# Altium schematic sheet IR2111+IRFZ44.SchDoc
size A3
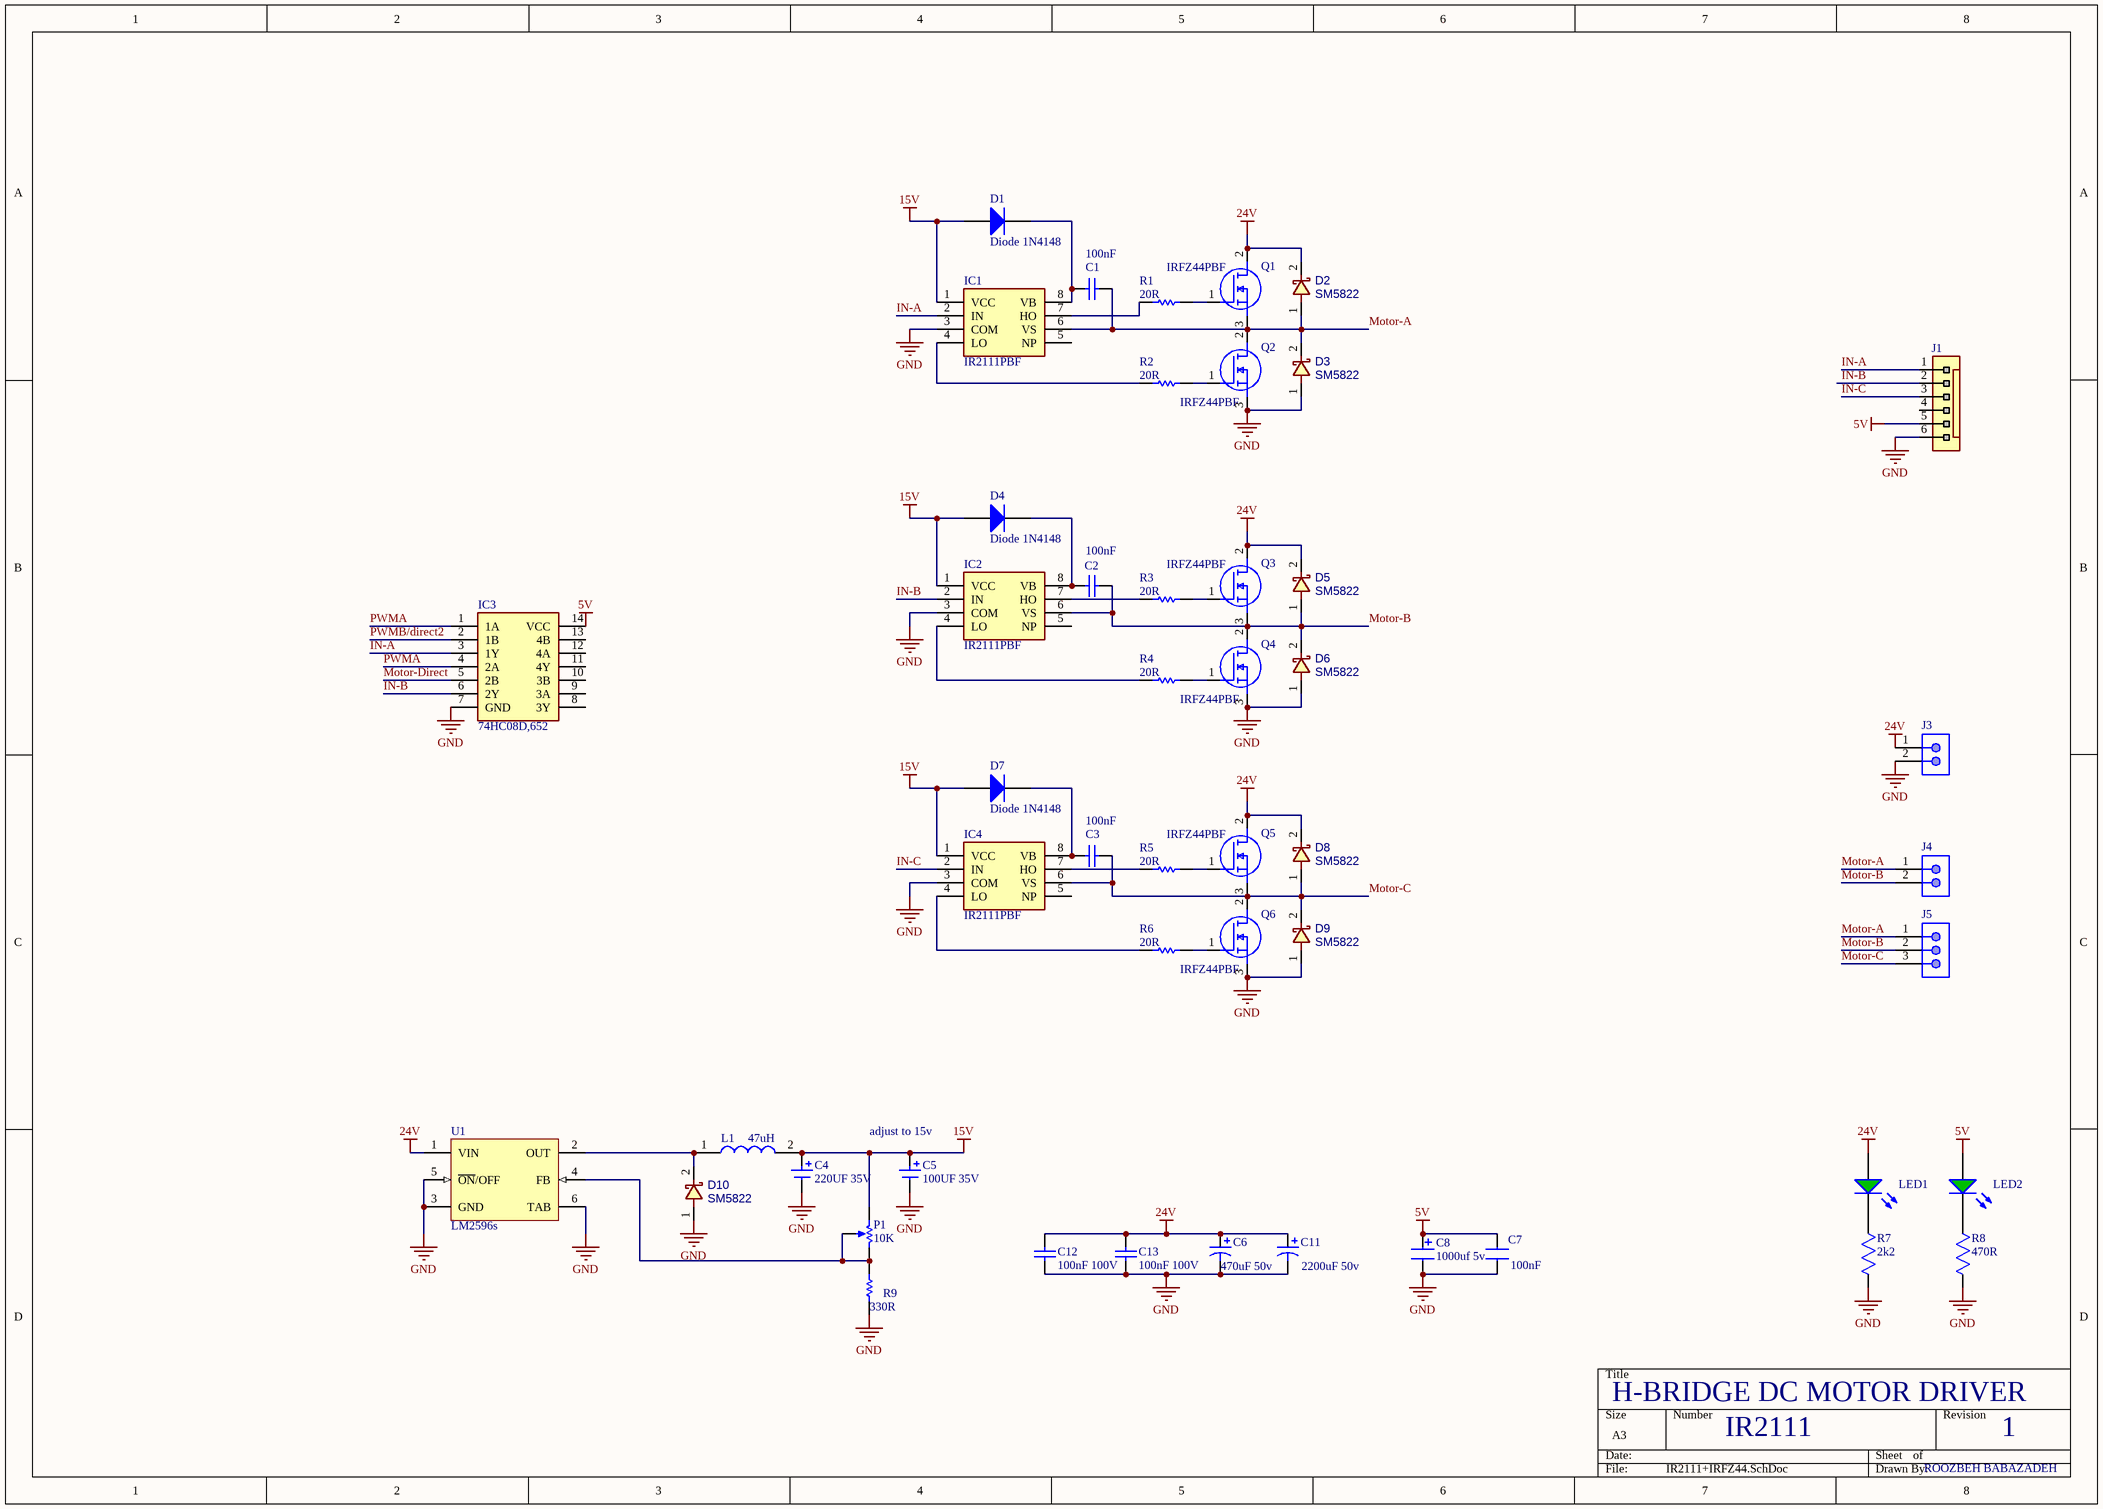
[diagram p0: IR2111+IRFZ44.SchDoc]

## Parts
C1  100nF  [C0805]
C2  100nF  [C0805]
C3  100nF  [C0805]
C4  220UF 35V  [C_EL_8X12]
C5  100UF 35V  [C_EL_8X12]
C6  470uF 50v  [C_EL_10X12]
C7  100nF  [C0805]
C8  1000uf 5v  [C_EL_8X12]
C11  2200uF 50v  [C_EL_16X25]
C12  100nF 100V  [C_CER_D7B]
C13  100nF 100V  [C_CER_D7B]
D1  Diode 1N4148  [D_SOD123W]
D2  SM5822  [D_SMB]
D3  SM5822  [D_SMB]
D4  Diode 1N4148  [D_SOD123W]
D5  SM5822  [D_SMB]
D6  SM5822  [D_SMB]
D7  Diode 1N4148  [D_SOD123W]
D8  SM5822  [D_SMB]
D9  SM5822  [D_SMB]
D10  SM5822  [D_SMB]
IC1  IR2111PBF  [SO_8]
IC2  IR2111PBF  [SO_8]
IC3  74HC08D,652  [SO_14]
IC4  IR2111PBF  [SO_8]
J1  HDRWF_6  [WF_6]  (value not drawn)
J3  2PIN  3.96  [PWL_2]  (value not drawn)
J4  2PIN  3.96  [PWL_2]  (value not drawn)
J5  3PIN  3.96  [PWL_3]  (value not drawn)
L1  47uH  [CDRH127LDNP560MC-12*12]
LED1  (no value)  [LED1206RED]
LED2  (no value)  [LED1206RED]
P1  10K  [POT_3296W]
Q1  IRFZ44PBF  [D2PAK3]
Q2  IRFZ44PBF  [D2PAK3]
Q3  IRFZ44PBF  [D2PAK3]
Q4  IRFZ44PBF  [D2PAK3]
Q5  IRFZ44PBF  [D2PAK3]
Q6  IRFZ44PBF  [D2PAK3]
R1  20R  [R0805]
R2  20R  [R0805]
R3  20R  [R0805]
R4  20R  [R0805]
R5  20R  [R0805]
R6  20R  [R0805]
R7  2k2  [R0805]
R8  470R  [R0805]
R9  330R  [R0805]
U1  LM2596s  [to-263-5 5d2pak LM2596S]

## Nets
5V: C7.2 C8.1 IC3.14(VCC) J1.5 LED2.1(A)
15V: C4.1 C5.1 D1.1(A) D4.1(A) D7.1(A) IC1.1(VCC) IC2.1(VCC) IC4.1(VCC) L1.2 P1.3(BOT)
24V: C6.1 C11.1 C12.2 C13.2 D2.2 D5.2 D8.2 J3.1 LED1.1(A) Q1.2(D) Q3.2(D) Q5.2(D) U1.1(VIN)
GND: C4.2 C5.2 C6.2 C7.1 C8.2 C11.2 C12.1 C13.1 D3.1 D6.1 D9.1 D10.1 IC1.3(COM) IC2.3(COM) IC3.7(GND) IC4.3(COM) J1.6 J3.2 Q2.3(S) Q4.3(S) Q6.3(S) R7.2 R8.2 R9.1 U1.3(GND) U1.5(~{ON}/OFF) U1.6(TAB)
IN-A: IC1.2(IN) IC3.3(1Y) J1.1
IN-B: IC2.2(IN) IC3.6(2Y) J1.2
IN-C: IC4.2(IN) J1.3
Motor-A: C1.1 D2.1 D3.2 IC1.6(VS) J4.1 J5.1 Q1.3(S) Q2.2(D)
Motor-B: C2.1 D5.1 D6.2 IC2.6(VS) J4.2 J5.2 Q3.3(S) Q4.2(D)
Motor-C: C3.1 D8.1 D9.2 IC4.6(VS) J5.3 Q5.3(S) Q6.2(D)
Motor-Direct: IC3.5(2B)
PWMA: IC3.1(1A) IC3.4(2A)
PWMB/direct2: IC3.2(1B)
NetC1_2: C1.2 D1.2(K) IC1.8(VB)
NetC2_2: C2.2 D4.2(K) IC2.8(VB)
NetC3_2: C3.2 D7.2(K) IC4.8(VB)
NetD10_2: D10.2 L1.1 U1.2(OUT)
NetIC1_4: IC1.4(LO) R2.1
NetIC1_7: IC1.7(HO) R1.1
NetIC2_4: IC2.4(LO) R4.1
NetIC2_7: IC2.7(HO) R3.1
NetIC4_4: IC4.4(LO) R6.1
NetIC4_7: IC4.7(HO) R5.1
NetLED1_2: LED1.2(K) R7.1
NetLED2_2: LED2.2(K) R8.1
NetP1_1: P1.1(TOP) P1.2(TAP) R9.2 U1.4(FB)
NetQ1_1: Q1.1(G) R1.2
NetQ2_1: Q2.1(G) R2.2
NetQ3_1: Q3.1(G) R3.2
NetQ4_1: Q4.1(G) R4.2
NetQ5_1: Q5.1(G) R5.2
NetQ6_1: Q6.1(G) R6.2

Not connected (* = marked no-connect by the designer): IC1 5(NP); IC2 5(NP); IC3 8(3Y) 9(3A) 10(3B) 11(4Y) 12(4A) 13(4B); IC4 5(NP); J1 4

## Notes on the sheet
- (near C5) adjust to 15v
- H-BRIDGE DC MOTOR DRIVER
- IR2111
- 1
- ROOZBEH BABAZADEH

## Library data of the parts
C1-C3 = Cap: Capacitor; Published: 8-Jun-2000; LatestRevisionDate: 17-Jul-2002; LatestRevisionNote: Re-released for DXP Platform.; PackageReference: RAD-0.3; Publisher: Altium Limited; PackageDescription: Radial Cap, Thru-Hole; 2 Leads; 0.3 in Pin Spacing; Value: 100nF
C4 C5 = CAP_ELECTRO_POLIMER
C6 C11 = Cap 220uF: 63VDC
C7 = C
C8 = CAP3528
C12 = Cap 100nF
C13 = Cap: 63VDC; Value: 10nF; Published: 8-Jun-2000; LatestRevisionDate: 17-Jul-2002; LatestRevisionNote: Re-released for DXP Platform.; PackageReference: RAD-0.3; Publisher: Altium Limited; PackageDescription: Radial Cap, Thru-Hole; 2 Leads; 0.3 in Pin Spacing
D1 = Diode 1N4005: Published: 8-Jun-2000; LatestRevisionDate: 17-Jul-2002; LatestRevisionNote: Re-released for DXP Platform.; DatasheetVersion: 1998; PackageVersion: Aug-1999; PackageReference: DO-41; Publisher: Altium Limited; PackageDescription: Diode, Axial; Body 5.2 x 2.7 mm (LxDia. max), Lead Dia. 0.86 mm (max); Code_JEDEC: DO-204-AL; ComponentLink1Description: Manufacturer Link; ComponentLink1URL: http://www.fairchildsemi.com/; ComponentLink2Description: Datasheet; ComponentLink2URL: http://www.fairchildsemi.com/ds/1N%2F1N4001.pdf
D2 D3 D5 D6 D8-D10 = SCHOTTKY: DIODE, SCHOTTKY, 50V, 3A; MANF: DIODES; MANF_P#: 1N5819HW-7-F; DESC: DESCRIPTION; PARAM2: 1A; PARAM: 40V; ASSEMBLY: ASSEMBLY; PRICE: PRICE; VALUE: ?
D4 D7 = Diode 1N4005: 1 Amp General Purpose Rectifier; Published: 8-Jun-2000; LatestRevisionDate: 17-Jul-2002; LatestRevisionNote: Re-released for DXP Platform.; DatasheetVersion: 1998; PackageVersion: Aug-1999; PackageReference: DO-41; Publisher: Altium Limited; PackageDescription: Diode, Axial; Body 5.2 x 2.7 mm (LxDia. max), Lead Dia. 0.86 mm (max); Code_JEDEC: DO-204-AL; ComponentLink1Description: Manufacturer Link; ComponentLink1URL: http://www.fairchildsemi.com/; ComponentLink2Description: Datasheet; ComponentLink2URL: http://www.fairchildsemi.com/ds/1N%2F1N4001.pdf
IC1 IC2 IC4 = IR2111PBF: Integrated Circuit; Manufacturer_Name: Infineon; Datasheet Link: https://componentsearchengine.com/Datasheets/2/IR2111PBF.pdf; Height: 5.33mm; Manufacturer_Part_Number: IR2111PBF; Arrow Part Number: IR2111PBF; Arrow Price/Stock: https://www.arrow.com/en/products/ir2111pbf/infineon-technologies-ag; Mouser Part Number: 942-IR2111PBF; Mouser Price/Stock: https://www.mouser.co.uk/ProductDetail/Infineon-IR/IR2111PBF?qs=dQmlx5f5cRIMSJ8myt%2FAiw%3D%3D
IC3 = 74HC08D,652: Integrated Circuit; Manufacturer_Name: Nexperia; Datasheet Link: http://www.nxp.com/documents/data_sheet/74HC_HCT08.pdf; Height: 1.75mm; Manufacturer_Part_Number: 74HC08D,652; Arrow Part Number: 74HC08D,652; Arrow Price/Stock: https://www.arrow.com/en/products/74hc08d652/nexperia; Mouser Part Number: 771-HC08D652; Mouser Price/Stock: https://www.mouser.co.uk/ProductDetail/Nexperia/74HC08D652?qs=P62ublwmbi%2FiQ9gkrEoLJQ%3D%3D
J1 = HDRWF_6: Header, WF, Pitch: 2.54mm; VALUE: HDRWF_6
J3 J4 = sip 2: wire to board pitch 3.96 mm CH series; Part Number: 61300211121; Pin Number: 2; Pitch: 2.54mm; Gender: Male; Rated Current: 3A; Working Voltage: 250VAC; Withstanding Voltage: 500VAC; Contact Resistance: 20mOhm; Row Number: Single; ComponentLink1Description: Manufacturer; ComponentLink1URL: http://www.we-online.de; ComponentLink2Description: Datasheet; ComponentLink2URL: https://katalog.we-online.de/em/datasheet/6130xx11121.pdf; Published Date: June 2019; Publisher: Wurth Elektronik; Operating Temperature: -40 to +105degC; Mounting Technology: THT; Packaging: Bag; Orientation: Vertical
J5 = sip 3: wire to board pitch 3.96 mm CH series; Part Number: 61300311121; Pin Number: 3; Pitch: 2.54mm; Gender: Male; Rated Current: 3A; Working Voltage: 250VAC; Withstanding Voltage: 500VAC; Contact Resistance: 20mOhm; Row Number: Single; ComponentLink1Description: Manufacturer; ComponentLink1URL: http://www.we-online.de; ComponentLink2Description: Datasheet; ComponentLink2URL: https://katalog.we-online.de/em/datasheet/6130xx11121.pdf; Published Date: June 2019; Publisher: Wurth Elektronik; Operating Temperature: -40 to +105degC; Mounting Technology: THT; Packaging: Bag; Orientation: Vertical
L1 = CDRH127_LDNP-560MC: Inductor; Manufacturer_Name: Sumida; Manufacturer_Part_Number: CDRH127/LDNP-560MC; Datasheet Link: https://www.arrow.com/en/products/cdrh127ldnp-560mc/sumida; Height: 8mm; Arrow Part Number: CDRH127/LDNP-560MC; Arrow Price/Stock: https://www.arrow.com/en/products/cdrh127ldnp-560mc/sumida; Mouser Part Number: 851-CDRH127LDNP560MC; Mouser Price/Stock: https://www.mouser.co.uk/ProductDetail/Sumida/CDRH127-LDNP-560MC?qs=IXCoV6m%252B579ap3iATSRauQ%3D%3D
LED1 LED2 = LED3mm
P1 = Multi-Turn: Potentiometer
Q1-Q6 = IRFZ44PBF: MOSFET (N-Channel); Manufacturer_Name: Vishay; Datasheet Link: https://www.vishay.com/docs/91291/91291.pdf; Height: 4.65mm; Manufacturer_Part_Number: IRFZ44PBF; Arrow Part Number: IRFZ44PBF; Arrow Price/Stock: https://www.arrow.com/en/products/irfz44pbf/vishay; Mouser Part Number: 844-IRFZ44PBF; Mouser Price/Stock: https://www.mouser.co.uk/ProductDetail/Vishay-Semiconductors/IRFZ44PBF?qs=%2FRKvNCQzLu0R%252BpFoqVUQ5w%3D%3D
R1-R6 R9 = Res1: Resistor; Published: 8-Jun-2000; LatestRevisionDate: 17-Jul-2002; LatestRevisionNote: Re-released for DXP Platform.; PackageReference: AXIAL-0.3; Publisher: Altium Limited; PackageDescription: Axial Device, Thru-Hole; 2 Leads; 0.3 in Pin Spacing
  R1-R6: Value: 20R
  R9: Value: 330R
R7 R8 = R